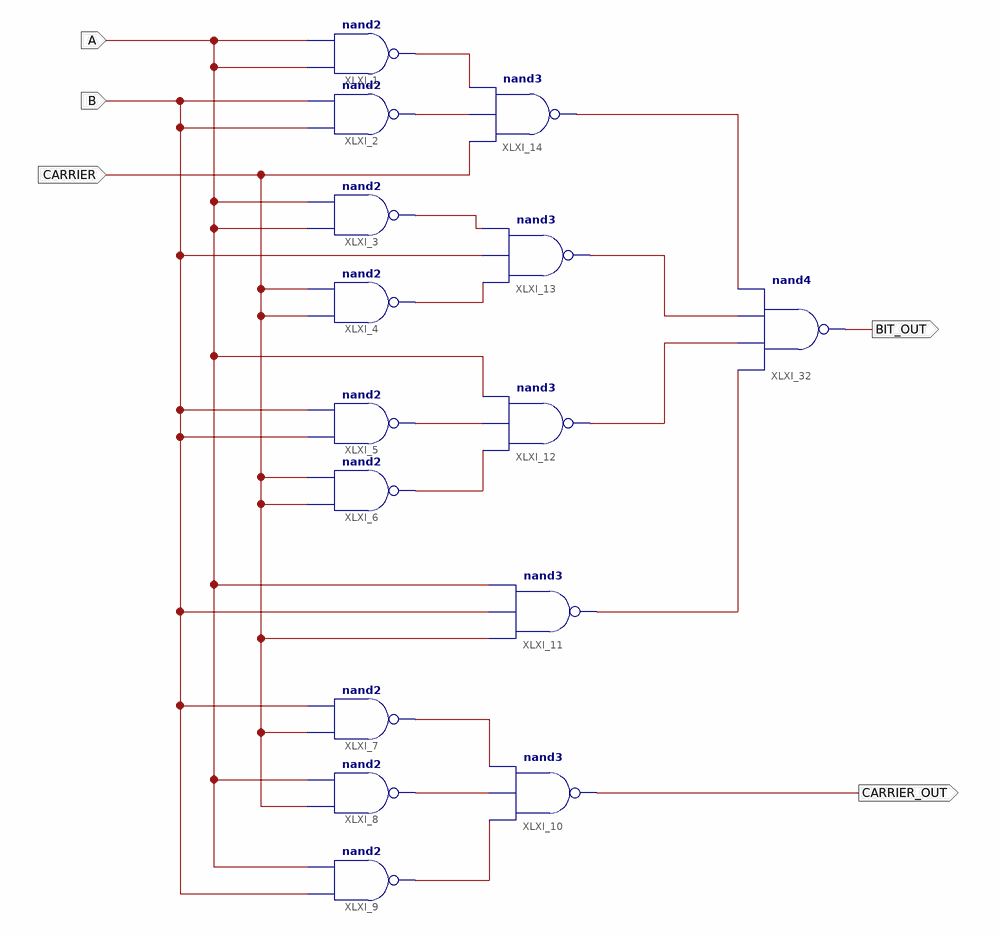
[diagram p0: schematic sheet 1]
// Xilinx ISE schematic AddBit.sch (spartan6) as structural Verilog: 15 symbols, 5 ports
module AddBit (
  input  A,
  input  B,
  input  CARRIER,
  output CARRIER_OUT,
  output BIT_OUT
);

  wire XLXN_1, XLXN_2, XLXN_3, XLXN_4, XLXN_5, XLXN_6, XLXN_7, XLXN_8, XLXN_9, XLXN_51, XLXN_52, XLXN_53,
       XLXN_54;

  nand XLXI_6 (XLXN_6, CARRIER, CARRIER);
  nand XLXI_7 (XLXN_7, CARRIER, B);
  nand XLXI_8 (XLXN_8, CARRIER, A);
  nand XLXI_9 (XLXN_9, B, A);
  nand XLXI_11 (XLXN_54, CARRIER, B, A);
  nand XLXI_13 (XLXN_52, XLXN_4, B, XLXN_3);
  nand XLXI_1 (XLXN_1, A, A);
  nand XLXI_2 (XLXN_2, B, B);
  nand XLXI_10 (CARRIER_OUT, XLXN_9, XLXN_8, XLXN_7);
  nand XLXI_14 (XLXN_51, CARRIER, XLXN_2, XLXN_1);
  nand XLXI_4 (XLXN_4, CARRIER, CARRIER);
  nand XLXI_3 (XLXN_3, A, A);
  nand XLXI_5 (XLXN_5, B, B);
  nand XLXI_12 (XLXN_53, XLXN_6, XLXN_5, A);
  nand XLXI_32 (BIT_OUT, XLXN_54, XLXN_53, XLXN_52, XLXN_51);
endmodule
